# Altium schematic sheet [3] SCHEMATIC.SchDoc
size A3
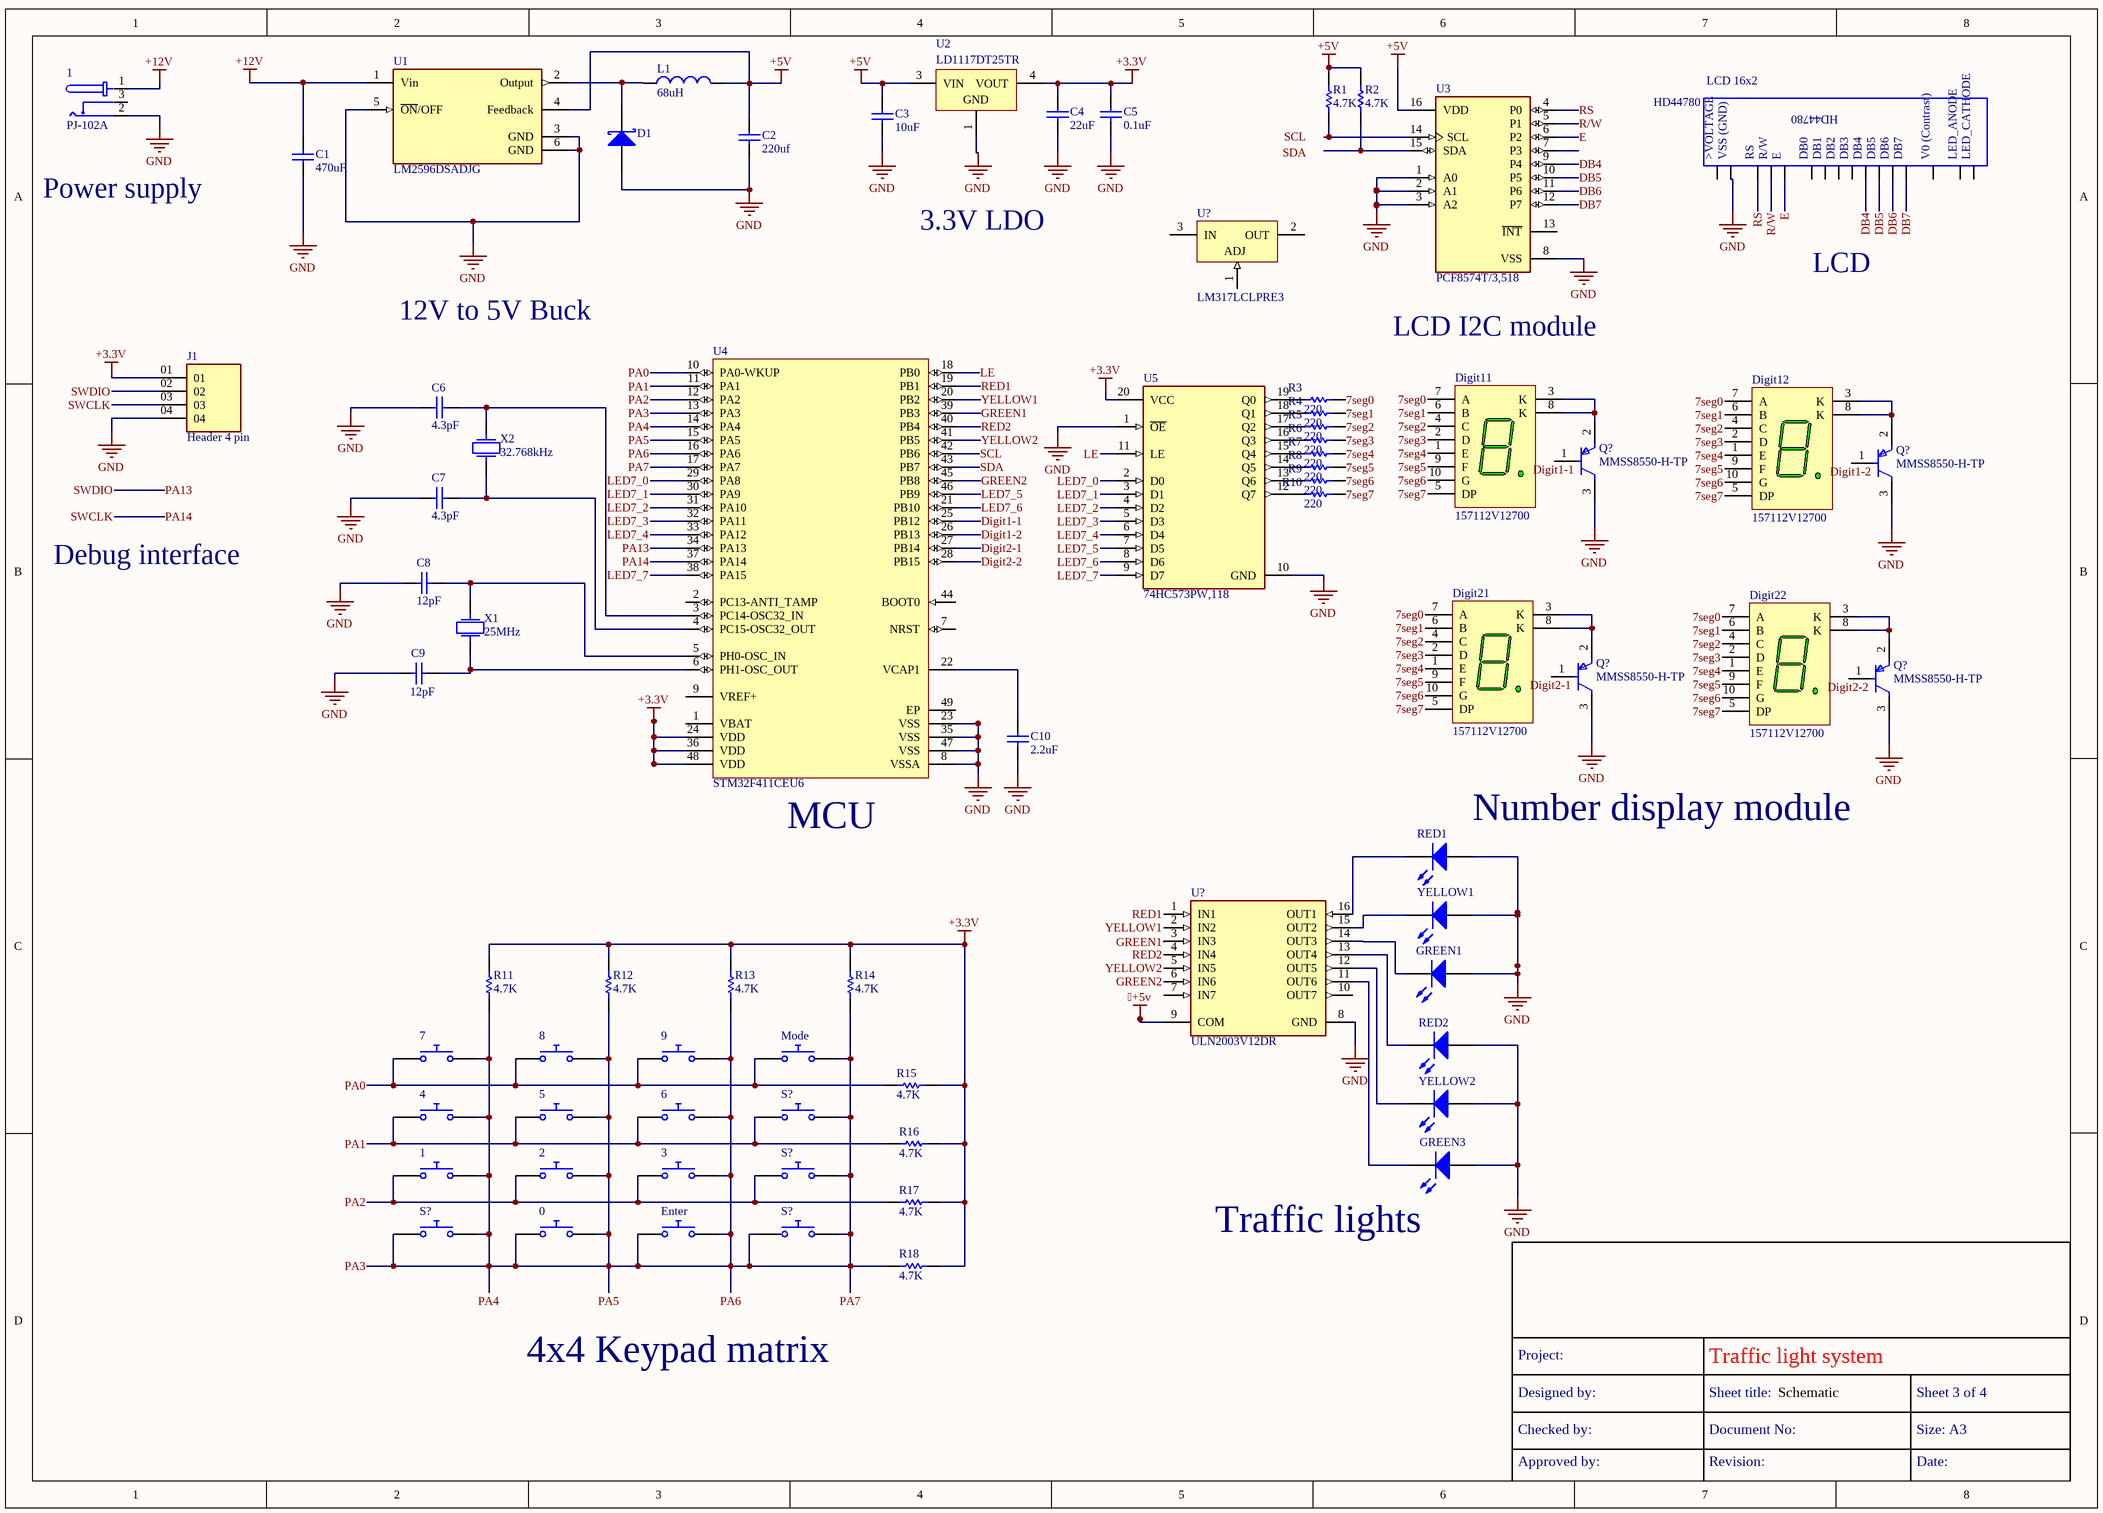
[diagram p0: [3] SCHEMATIC.SchDoc]

## Parts
(Parts that share a designator on the sheet are numbered #1, #2 ... from top to bottom, then left to right.)
0  Push Button Normally Opened  (value not drawn)
1#1  PJ-102A  [CUI_PJ-102A]
1#2  Push Button Normally Opened  (value not drawn)
2  Push Button Normally Opened  (value not drawn)
3  Push Button Normally Opened  (value not drawn)
4  Push Button Normally Opened  (value not drawn)
5  Push Button Normally Opened  (value not drawn)
6  Push Button Normally Opened  (value not drawn)
7  Push Button Normally Opened  (value not drawn)
8  Push Button Normally Opened  (value not drawn)
9  Push Button Normally Opened  (value not drawn)
C1  value 470uF  (hidden comment: Capacitor)
C2  value 220uf  (hidden comment: Capacitor)
C3  value 10uF  (hidden comment: Capacitor)
C4  value 22uF  (hidden comment: Capacitor)
C5  value 0.1uF  (hidden comment: Capacitor)
C6  value 4.3pF  (hidden comment: Capacitor)
C7  value 4.3pF  (hidden comment: Capacitor)
C8  value 12pF  (hidden comment: Capacitor)
C9  value 12pF  (hidden comment: Capacitor)
C10  value 2.2uF  (hidden comment: Capacitor)
D1  Schottky Diode  (value not drawn)
Digit11  157112V12700  [WL-S7DS_L12W7.3H3.75]
Digit12  157112V12700  [WL-S7DS_L12W7.3H3.75]
Digit21  157112V12700  [WL-S7DS_L12W7.3H3.75]
Digit22  157112V12700  [WL-S7DS_L12W7.3H3.75]
Enter  Push Button Normally Opened  (value not drawn)
GREEN1  Light-Emitting Diode  (value not drawn)
GREEN3  Light-Emitting Diode  (value not drawn)
J1  Header 4 pin  [SAMTEC_MTLW-104-X-X-S-X]
L1  value 68uH  (hidden comment: Inductor)
LCD_16x2  HD44780  [16026-16X2]
Mode  Push Button Normally Opened  (value not drawn)
Q?#1  MMSS8550-H-TP  [FP-SOT-23-IPC_A]
Q?#2  MMSS8550-H-TP  [FP-SOT-23-IPC_A]
Q?#3  MMSS8550-H-TP  [FP-SOT-23-IPC_A]
Q?#4  MMSS8550-H-TP  [FP-SOT-23-IPC_A]
R1  value 4.7K  (hidden comment: Resistor)
R2  value 4.7K  (hidden comment: Resistor)
R3  value 220  (hidden comment: Resistor)
R4  value 220  (hidden comment: Resistor)
R5  value 220  (hidden comment: Resistor)
R6  value 220  (hidden comment: Resistor)
R7  value 220  (hidden comment: Resistor)
R8  value 220  (hidden comment: Resistor)
R9  value 220  (hidden comment: Resistor)
R10  value 220  (hidden comment: Resistor)
R11  value 4.7K  (hidden comment: Resistor)
R12  value 4.7K  (hidden comment: Resistor)
R13  value 4.7K  (hidden comment: Resistor)
R14  value 4.7K  (hidden comment: Resistor)
R15  value 4.7K  (hidden comment: Resistor)
R16  value 4.7K  (hidden comment: Resistor)
R17  value 4.7K  (hidden comment: Resistor)
R18  value 4.7K  (hidden comment: Resistor)
RED1  Light-Emitting Diode  (value not drawn)
RED2  Light-Emitting Diode  (value not drawn)
S?#1  Push Button Normally Opened  (value not drawn)
S?#2  Push Button Normally Opened  (value not drawn)
S?#3  Push Button Normally Opened  (value not drawn)
S?#4  Push Button Normally Opened  (value not drawn)
U1  LM2596DSADJG  [FP-936A-02-MFG]
U2  LD1117DT25TR  [TO-252_L]
U3  PCF8574T/3,518  [FP-SOT162-1-MFG]
U4  STM32F411CEU6  [STM-UFQFPN48_L]
U5  74HC573PW,118  [FP-SOT360-1-IPC_B]
U?#1  LM317LCLPRE3  [LP3]
U?#2  ULN2003V12DR  [FP-D0016A-MFG]
X1  F0: 25MHz  (hidden comment: Crystal)
X2  F0: 32.768kHz  (hidden comment: Crystal)
YELLOW1  Light-Emitting Diode  (value not drawn)
YELLOW2  Light-Emitting Diode  (value not drawn)

## Nets
+5v: C4.2 C5.2 J1.01 R11.2 R12.2 R13.2 R14.2 R15.1 R16.1 R17.1 R18.1 U2.4(VOUT) U4.24(VDD) U4.36(VDD) U4.48(VDD) U5.20(VCC) U?#2.9(COM)  [also labelled +3.3V]
+5V: C2.2 C3.2 L1.2 R1.2 R2.2 U1.4(Feedback) U2.3(VIN) U3.16(VDD)
+12V: 1#1.1 C1.2 U1.1(Vin)
GND: 1#1.2 C1.1 C2.1 C3.1 C4.1 C5.1 C6.1 C7.1 C8.1 C9.1 C10.2 D1.1(A) GREEN1.1(A) GREEN3.1(A) J1.04 LCD_16x2.P$1(VSS) Q?#1.3(C) Q?#2.3(C) Q?#3.3(C) Q?#4.3(C) RED1.1(A) RED2.1(A) U1.3(GND) U1.5(~{ON}/OFF) U1.6(GND) U2.1(GND) U3.1(A0) U3.2(A1) U3.3(A2) U3.8(VSS) U4.8(VSSA) U4.23(VSS) U4.35(VSS) U4.47(VSS) U5.1(~{OE}) U5.10(GND) U?#2.8(GND) YELLOW1.1(A) YELLOW2.1(A)
7seg0: Digit11.7(A) Digit12.7(A) Digit21.7(A) Digit22.7(A) R3.2
7seg1: Digit11.6(B) Digit12.6(B) Digit21.6(B) Digit22.6(B) R4.2
7seg2: Digit11.4(C) Digit12.4(C) Digit21.4(C) Digit22.4(C) R5.2
7seg3: Digit11.2(D) Digit12.2(D) Digit21.2(D) Digit22.2(D) R6.2
7seg4: Digit11.1(E) Digit12.1(E) Digit21.1(E) Digit22.1(E) R7.2
7seg5: Digit11.9(F) Digit12.9(F) Digit21.9(F) Digit22.9(F) R8.2
7seg6: Digit11.10(G) Digit12.10(G) Digit21.10(G) Digit22.10(G) R9.2
7seg7: Digit11.5(DP) Digit12.5(DP) Digit21.5(DP) Digit22.5(DP) R10.2
DB4: LCD_16x2.P$11(DB4) U3.9(P4)
DB5: LCD_16x2.P$12(DB5) U3.10(P5)
DB6: LCD_16x2.P$13(DB6) U3.11(P6)
DB7: LCD_16x2.P$14(DB7) U3.12(P7)
Digit1-1: Q?#1.1(B) U4.25(PB12)
Digit1-2: Q?#2.1(B) U4.26(PB13)
Digit2-1: Q?#3.1(B) U4.27(PB14)
Digit2-2: Q?#4.1(B) U4.28(PB15)
E: LCD_16x2.P$6(E) U3.6(P2)
GREEN1: U4.39(PB3) U?#2.3(IN3)
GREEN2: U4.45(PB8) U?#2.6(IN6)
LE: U4.18(PB0) U5.11(LE)
LED7_0: U4.29(PA8) U5.2(D0)
LED7_1: U4.30(PA9) U5.3(D1)
LED7_2: U4.31(PA10) U5.4(D2)
LED7_3: U4.32(PA11) U5.5(D3)
LED7_4: U4.33(PA12) U5.6(D4)
LED7_5: U4.46(PB9) U5.7(D5)
LED7_6: U4.21(PB10) U5.8(D6)
LED7_7: U4.38(PA15) U5.9(D7)
PA0: 7.1 8.1 9.1 Mode.1 R15.2 U4.10(PA0-WKUP)
PA1: 4.1 5.1 6.1 R16.2 S?#1.1 U4.11(PA1)
PA2: 1#2.1 2.1 3.1 R17.2 S?#2.1 U4.12(PA2)
PA3: 0.1 0.2 1#2.2 2.2 3.2 4.2 5.2 6.2 7.2 8.2 9.2 Enter.1 Enter.2 Mode.2 R11.1 R12.1 R13.1 R14.1 R18.2 S?#1.2 S?#2.2 S?#3.1 S?#3.2 S?#4.1 S?#4.2 U4.13(PA3) U4.14(PA4) U4.15(PA5) U4.16(PA6) U4.17(PA7)  [also labelled PA4, PA5, PA6, PA7]
PA13: J1.02 U4.34(PA13)  [also labelled SWDIO]
PA14: J1.03 U4.37(PA14)  [also labelled SWCLK]
R/W: LCD_16x2.P$5(R/W) U3.5(P1)
RED1: U4.19(PB1) U?#2.1(IN1)
RED2: U4.40(PB4) U?#2.4(IN4)
RS: LCD_16x2.P$4(RS) U3.4(P0)
SCL: U4.42(PB6)
SDA: U4.43(PB7)
YELLOW1: U4.20(PB2) U?#2.2(IN2)
YELLOW2: U4.41(PB5) U?#2.5(IN5)
NetC6_2: C6.2 U4.3(PC14-OSC32_IN) X2.2
NetC7_2: C7.2 U4.4(PC15-OSC32_OUT) X2.1
NetC8_2: C8.2 U4.5(PH0-OSC_IN) X1.2
NetC9_2: C9.2 U4.6(PH1-OSC_OUT) X1.1
NetC10_1: C10.1 U4.22(VCAP1)
NetD1_2: D1.2(K) L1.1 U1.2(Output)
NetDigit11_3: Digit11.3(K) Digit11.8(K) Q?#1.2(E)
NetDigit12_3: Digit12.3(K) Digit12.8(K) Q?#2.2(E)
NetDigit21_3: Digit21.3(K) Digit21.8(K) Q?#3.2(E)
NetDigit22_3: Digit22.3(K) Digit22.8(K) Q?#4.2(E)
NetGREEN1_2: GREEN1.2(K) U?#2.14(OUT3)
NetGREEN3_2: GREEN3.2(K) U?#2.11(OUT6)
NetR1_1: R1.1 U3.14(SCL)
NetR2_1: R2.1 U3.15(SDA)
NetR3_1: R3.1 U5.19(Q0)
NetR4_1: R4.1 U5.18(Q1)
NetR5_1: R5.1 U5.17(Q2)
NetR6_1: R6.1 U5.16(Q3)
NetR7_1: R7.1 U5.15(Q4)
NetR8_1: R8.1 U5.14(Q5)
NetR9_1: R9.1 U5.13(Q6)
NetR10_1: R10.1 U5.12(Q7)
NetRED1_2: RED1.2(K) U?#2.16(OUT1)
NetRED2_2: RED2.2(K) U?#2.13(OUT4)
NetU?#2_12: U?#2.12(OUT5) YELLOW2.2(K)
NetU?#2_15: U?#2.15(OUT2) YELLOW1.2(K)

Not connected (* = marked no-connect by the designer): 1#1 3; LCD_16x2 P$2(VDD) P$3(CONTRAST) P$7(DB0) P$8(DB1) P$9(DB2) P$10(DB3) P$15(LED_A) P$16(LED_C); U3 7(P3) 13(~{INT}); U4 1(VBAT) 2(PC13-ANTI_TAMP) 7(NRST) 9(VREF+) 44(BOOT0) 49(EP); U?#1 1(ADJ) 2(OUT) 3(IN); U?#2 7(IN7) 10(OUT7)

## Notes on the sheet
- Power supply
- 3.3V LDO
- LCD
- 12V to 5V Buck
- LCD I2C module
- Debug interface
- (near U4) MCU
- (near RED1) Number display module
- (near GREEN3) Traffic lights
- 4x4 Keypad matrix
- Project:
- Designed by:
- Traffic light system
- Sheet title:
- Schematic
- Sheet 3 of 4
- Approved by:
- Checked by:
- Document No:
- Revision:
- Size: A3
- Date:
- Labels drawn without touching a wire or pin: SCL, SDA
- (in symbol HD44780) >VOLTAGE; VSS (GND); V0 (Contrast); LED_ANODE; LED_CATHODE

## Library data of the parts
0 1#2 2-9 Enter Mode S?#1-S?#4 = Push Button NO: closed: 0; Rclosed: 1m; Ropen: 1Meg; SimulationGenericComponent: True
1#1 = PJ-102A: 2.0 x 6.5 mm, 2.5 A, Horizontal, Through Hole, Tapered Pins, Dc Power Jack Connector; MF: Same Sky; SnapEDA_Link: https://www.snapeda.com/parts/PJ-102A/Same+Sky/view-part/?ref=snap; Package: None; Value: *; MP: PJ-102A; Check_prices: https://www.snapeda.com/parts/PJ-102A/Same+Sky/view-part/?ref=eda
C1-C10 = Capacitor: SimulationGenericComponent: True
D1 = Schottky Diode: AF: 1; BV: 0; BV_MAX: 1e99; EG: 1.11; FC: 0.5; IBV: 0.001; IS: 1e-14; MJSW: 0.33; NTUN: 30; TNOM: 27; XTI: 3; SimulationGenericComponent: True; CJO: 0; CJP: 0; CTA: 0; CTP: 0; FCS: 0.5; FV_MAX: 1e99; IKF: 0; IKR: 0; ISR: 1e-14; JSW: 0; JTUN: 0; JTUNSW: 0; KEG: 1; KF: 0; LEVEL: 1; N: 1; NBV: 1; NR: 1; NS: 1; PHP: 1; RS: 0; TCV: 0; TLEV: 0; TLEVC: 0; TM1: 0; TM2: 0; TPB: 0; TPHP: 0; TRS: 0; TRS2: 0; TT: 0; TTT1: 0; TTT2: 0; VJ: 1; XTITUN: 3
Digit11 Digit12 Digit21 Digit22 = CMP-03913-119893988-3: 7-Seg Display, Comm Cathode, Grn, 21Mcd Rohs Compliant: Yes |Wurth Elektronik 157112V12700; Dominant Wavelength: 570nm; Forward Voltage: 2V; Max Reverse Voltage (DC): 5V; Luminous Intensity: 12mcd; Forward Current: 100mA; Height: 3.75mm; Length: 12mm; RoHS: Compliant; Width: 7.3mm; Max Operating Temperature: 85°C; Min Operating Temperature: -35°C
GREEN1 GREEN3 RED1 RED2 YELLOW1 YELLOW2 = LED: AF: 1; BV: 0; BV_MAX: 1e99; EG: 1.11; FC: 0.5; IBV: 0.001; IS: 1e-14; MJSW: 0.33; NTUN: 30; TNOM: 27; XTI: 3; SimulationGenericComponent: True; CJO: 0; CJP: 0; CTA: 0; CTP: 0; FCS: 0.5; FV_MAX: 1e99; IKF: 0; IKR: 0; ISR: 1e-14; JSW: 0; JTUN: 0; JTUNSW: 0; KEG: 1; KF: 0; LEVEL: 1; N: 1; NBV: 1; NR: 1; NS: 1; PHP: 1; RS: 0; TCV: 0; TLEV: 0; TLEVC: 0; TM1: 0; TM2: 0; TPB: 0; TPHP: 0; TRS: 0; TRS2: 0; TT: 0; TTT1: 0; TTT2: 0; VJ: 1; XTITUN: 3
J1 = MTLW-104-X-X-S-X: MF: {'manufacturer': u'Samtec Inc.'}; Package: None; Price: None; Value: *; MP: MTLW-104-X-X-S-X; Availability: Unavailable
L1 = Inductor: SimulationGenericComponent: True
LCD_16x2 = HD44780: Character LCD Display Module Transflective 5 x 8 Dots STN - Super-Twisted Nematic LED - White Parallel 98.00mm x 60.00mm x 11.60mm; MF: Lumex Opto/Components; SnapEDA_Link: https://www.snapeda.com/parts/HD44780/Lumex%20Opto/Components%20Inc./view-part/44140/?ref=snap; Price: None; Availability: Unavailable; Package: None; MP: HD44780; Value: *
Q?#1-Q?#4 = CMP-56214-000002-1: TRANS PNP 25V 1.5A SOT23; Emitter Base Voltage (VEBO): 1.6V; Collector Base Voltage (VCBO): 40V; Collector Emitter Saturation Voltage: 500mV; Max Power Dissipation: 625mW; Transition Frequency: 100MHz; Element Configuration: Single; hFE Min: 40; Polarity: PNP; Lead Free: Lead Free; Max Breakdown Voltage: 25V; Package Quantity: 1; Min Operating Temperature: -55°C; Case/Package: SOT-23; Max Collector Current: 1.5A; Mount: Surface Mount; Packaging: Tape and Reel; Collector Emitter Voltage (VCEO): 500mV; Max Operating Temperature: 150°C; Gain Bandwidth Product: 100MHz; Collector Emitter Breakdown Voltage: 25V
R1-R18 = Resistor: TC1: 0; SimulationGenericComponent: True; TC2: 0
U1 = CMP-07129-000001-1: IC REG MULT CONFG ADJ 3A D2PAK-5; Manufacturer: ON Semiconductor; Max Duty Cycle: 95%; Nominal Supply Current: 5mA; Standoff Height: 0mm; Min Supply Voltage: 4.5V; Output Voltage: 1.23-37V; Negative Voltage Available: true; Number Of Outputs: 1; Max Junction Temp: +125°C; Output Type: AdjustableProgrammable; Max Supply Voltage: 40V; Switching Topology: Boost,Buck,Buck-Boost; Switching Frequency: 150Hz; Output Current: 3A; Device Class L1: Integrated Circuits (ICs); Height: 4.826mm; Manufacturer Part Number: LM2596DSADJG; ComponentLink2URL: https://www.onsemi.com/pub/Collateral/LM2596-D.PDF; Device Class L3: Voltage Regulators - Switching; Octopart: https://octopart.com/lm2596dsadjg-on+semiconductor-12437034; Mouser Description: Voltage Regulators - Switching Regulators 3A BUCK SWCH 150KHZ; Automotive: No; RoHS: TRUE; Temperature Range High: +125°C; ComponentLink2Description: Datasheet; Device Class L2: Power Management ICs; Digikey Description: IC REG MULT CONFG ADJ 3A D2PAK-5; Temperature Range Low: -40°C; Footprint Url: https://www.onsemi.com/pub/Collateral/936A-02.PDF; Lead Free: Yes; Temperature: -40°C to +125°C; Package: 936A-02; Category: IC
U2 = CMP-0244-00090-1: Fixed Low Drop Positive Voltage Regulator, 3-Pin DPAK, Tape and Reel; DatasheetVersion: 1/11/2011; ComponentLink2Description: Datasheet; PackageVersion: 2011; PackageDescription: 3-Pin Transistor Outline Package 2.28 mm Pitch, 9.7 mm Lead Span (DPAK); PackageReference: TO-252; ComponentLink1URL: http://www.st.com; ComponentLink2URL: http://www.st.com/internet/com/TECHNICAL_RESOURCES/TECHNICAL_LITERATURE/DATASHEET/CD00000544.pdf; ComponentLink1Description: Manufacturer URL
U3 = CMP-10112-000010-1: IC I/O EXPANDER I2C 8B 16SOIC; Manufacturer: NXP Semiconductors; Frequency: 100kHz; Max Supply Voltage: 6V; Standoff Height: 0.1mm; Nominal Supply Current: 40uA; Max Junction Temp: +125°C; Min Supply Voltage: 2.5V; Number Of I/Os: 8; Manufacturer Part Number: PCF8574T/3,518; Footprint Url: https://www.nxp.com/docs/en/package-information/SOT162-1.pdf; ComponentLink2URL: https://www.nxp.com/docs/en/data-sheet/PCF8574_PCF8574A.pdf; Automotive: No; Digikey Description: IC I/O EXPANDER I2C 8B 16SOIC; Mouser Description: PCF8574 Series 2.5 - 6V Remote 8-bit I/O Expander for I2C-bus - SOIC-16; Ipc Land Pattern Name: SOIC127P1032X265-16; Interface: I2C; Octopart: https://octopart.com/pcf8574t%2F3%2C518-nxp+semiconductors-10470852; Ambient Temperature Range Low: -40°C; Lead Free: Yes; Device Class L2: Interface ICs; Temperature Range High: +85°C; Device Class L1: Integrated Circuits (ICs); Package: SOT162-1; ComponentLink2Description: Datasheet; Device Class L3: I/O Expanders; Temperature: -40°C to +85°C; Ambient Temperature Range High: +85°C; Height: 2.65mm; Category: IC; RoHS: TRUE; Temperature Range Low: -40°C
U4 = CMP-0243-00165-1: ARM Cortex-M4 32-bit MCU+FPU, 512 KB Flash, 128 KB RAM, 36 I/Os, 48-Pin UFQFPN, -40 to 85 degC, Tray; Operating Frequency(F) (Processor speed) (MHz): 100; FLASH Size (Prog) (kB): 512; Internal RAM Size (kB): 128; I/Os (High Current): 36; Supply Voltage(Vcc) min (V): 1.7; Package Reference: 48-Pin Ultra Thin Fine Pitch Quad Flat No-Lead, 7 x 7 x 0.6 mm Body, 0.5 mm Pitch, Exposed Pad; ComponentLink1Description: Manufacturer URL; ComponentLink1URL: http://www.st.com/; Packing: Tray; Package Description: UFQFPN48; Core: ARM Cortex-M4; ComponentLink2Description: Datasheet; ComponentLink2URL: http://www.st.com/st-web-ui/static/active/en/resource/technical/document/datasheet/DM00115249.pdf; DatasheetVersion: Rev. 6; Mounting Technology: Surface Mount
U5 = CMP-14349-000002-1: IC LATCH OCTAL D 3STATE 20TSSOP; Manufacturer: Nexperia; Number Of Inputs: 8; Max Supply Voltage: 6V; Number Of Circuits: 1; Nominal Supply Current: 8-160uA; Min Supply Voltage: 2V; Propagation Delay: 14ns; Logic Function Desc: Non-Inverting; Standoff Height: 0.05mm; Temperature Range High: +125°C; Ambient Temperature Range Low: -40°C; RoHS: TRUE; Temperature: -40°C to +125°C; Octopart: https://octopart.com/74hc573pw%2C118-nexperia-78737359; Automotive: No; Footprint Url: https://assets.nexperia.com/documents/outline-drawing/SOT360-1.pdf; Temperature Range Low: -40°C; Category: IC; ComponentLink2Description: Datasheet; Number Of Outputs: 8; Lead Free: Yes; Ipc Land Pattern Name: SOP65P640X110-20; Digikey Description: IC LATCH OCTAL D 3STATE 20TSSOP; Ambient Temperature Range High: +125°C; ComponentLink2URL: https://assets.nexperia.com/documents/data-sheet/74HC_HCT573.pdf; Package: SOT360-1; Device Class L2: Logic ICs; Device Class L3: Latches and Flip Flops; Device Class L1: Integrated Circuits (ICs); Manufacturer Part Number: 74HC573PW,118; Height: 1.1mm
U?#1 = CMP-0324-00071-2: Adjustable Regulator with 3.7 to 38 V Input and 1.2 to 32 V Output, 0 to 125 degC, 3-Pin TO-92 (LP), Pb-Free (RoHS); Manufacturer: Texas Instruments; SubFamily: Single Channel LDO; Vout(Max)(V): 32; Vout(Min)(V): 1.2; Vin(Min)(V): 3.7; Vin(Max)(V): 38; Iout(Max)(A): 0.1; Code_JEDEC: TO-226-AA; ComponentLink1Description: Datasheet; ComponentLink2Description: Package Specification; PackageReference: LP3; ComponentLink3URL: Samples URL:http://www.ti.com/product/lm317l#samples; DatasheetVersion: SLCS144D; PackageDescription: Plastic Cylindrical Package, Formed Lead Option (TO-92); PartNumber: LM317LCLPRE3; Eco-Plan: Pb-Free (RoHS); ComponentLink3Description: URL Link1; ComponentLink1URL: http://www.ti.com/general/docs/lit/getliterature.tsp?genericPartNumber=LM317L&fileType=pdf; Mounting Technology: Through Hole; PackageVersion: revC, Oct-2001; ComponentLink2URL: http://www.ti.com/litv/pdf/msot002a
U?#2 = CMP-04912-000075-1: MOSFET 7CH 16SOIC; Power Dissipation: 860mW; Output Current: 140mA; Collector Emitter Voltage (VCEO): 20V; Collector Emitter Saturation Voltage: 750mV; Output Voltage: 16V; Number of Drivers: 7; Number of Pins: 16; RoHS Compliant: Yes; Height: 1.5mm; Package Quantity: 1; REACH SVHC: No SVHC; Series: -; Min Operating Temperature: -40°C; Max Power Dissipation: 860mW; Max Collector Current: 140mA; Mount: Surface Mount; Packaging: Tape and Reel; Radiation Hardening: No; Case/Package: SOIC; Max Operating Temperature: 85°C; Number of Outputs: 7; Lead Free: Lead Free; Width: 4mm; Weight: 0.004998oz; Length: 10mm
X1 X2 = Crystal: R: 500; Q: 50K; SimulationGenericComponent: True